# Altium schematic sheet Inductor.SchDoc: Inductor
size A; DocumentNumber: 1; SheetNumber: 1; SheetTotal: 1
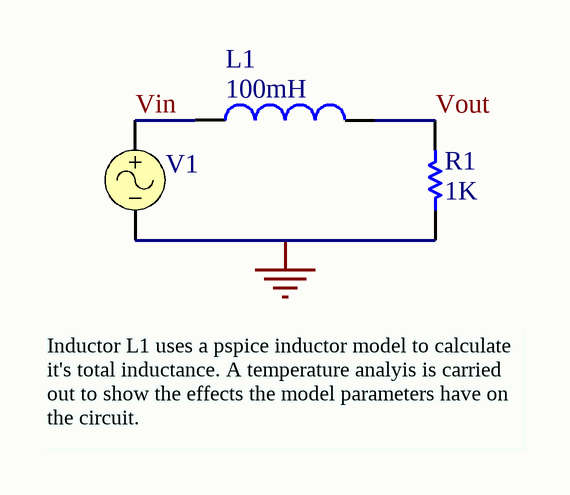
[diagram p0: Inductor.SchDoc]

## Parts
L1  value 100mH  [INDC1005-0402]  (hidden comment: Inductor)
R1  value 1K  [AXIAL-0.3]  (hidden comment: Res1)
V1  VSIN  (value not drawn)

## Nets
GND: R1.1 V1.2
Vin: L1.1 V1.1
Vout: L1.2 R1.2

## Notes on the sheet
- Inductor L1 uses a pspice inductor model to calculate it's total inductance. A temperature analyis is carried out to show the effects the model parameters have on the circuit.
- Title
- Size:
- Date:
- A
- Number:
- Time:
- Revision:
- Sheet
- of
- File:

## Library data of the parts
L1 = Inductor: Code_IEC: 1005; Published: 8-Jun-2000; LatestRevisionDate: 17-Jul-2002; LatestRevisionNote: Re-released for DXP Platform.; PackageReference: 0402-A; Publisher: Altium Limited; Code_JEITA: 0402
R1 = Res1: Resistor; Published: 8-Jun-2000; LatestRevisionDate: 17-Jul-2002; LatestRevisionNote: Re-released for DXP Platform.; Publisher: Altium Limited
V1 = VSIN: Sinusoidal Voltage Source; Note: PCB Footprint - Not required; Published: 8-Jun-2000; LatestRevisionDate: 15-Nov-2004; LatestRevisionNote: Corrected Netlist.; PackageReference: Not Applicable; Publisher: Altium Limited